# EasyEDA schematic display board.json
TITLE: Sheet_1; REV: 1.0; Date: 2021-07-18; Sheet: 1/1; Drawn By: Gustavo Moraes; Company: Your Company
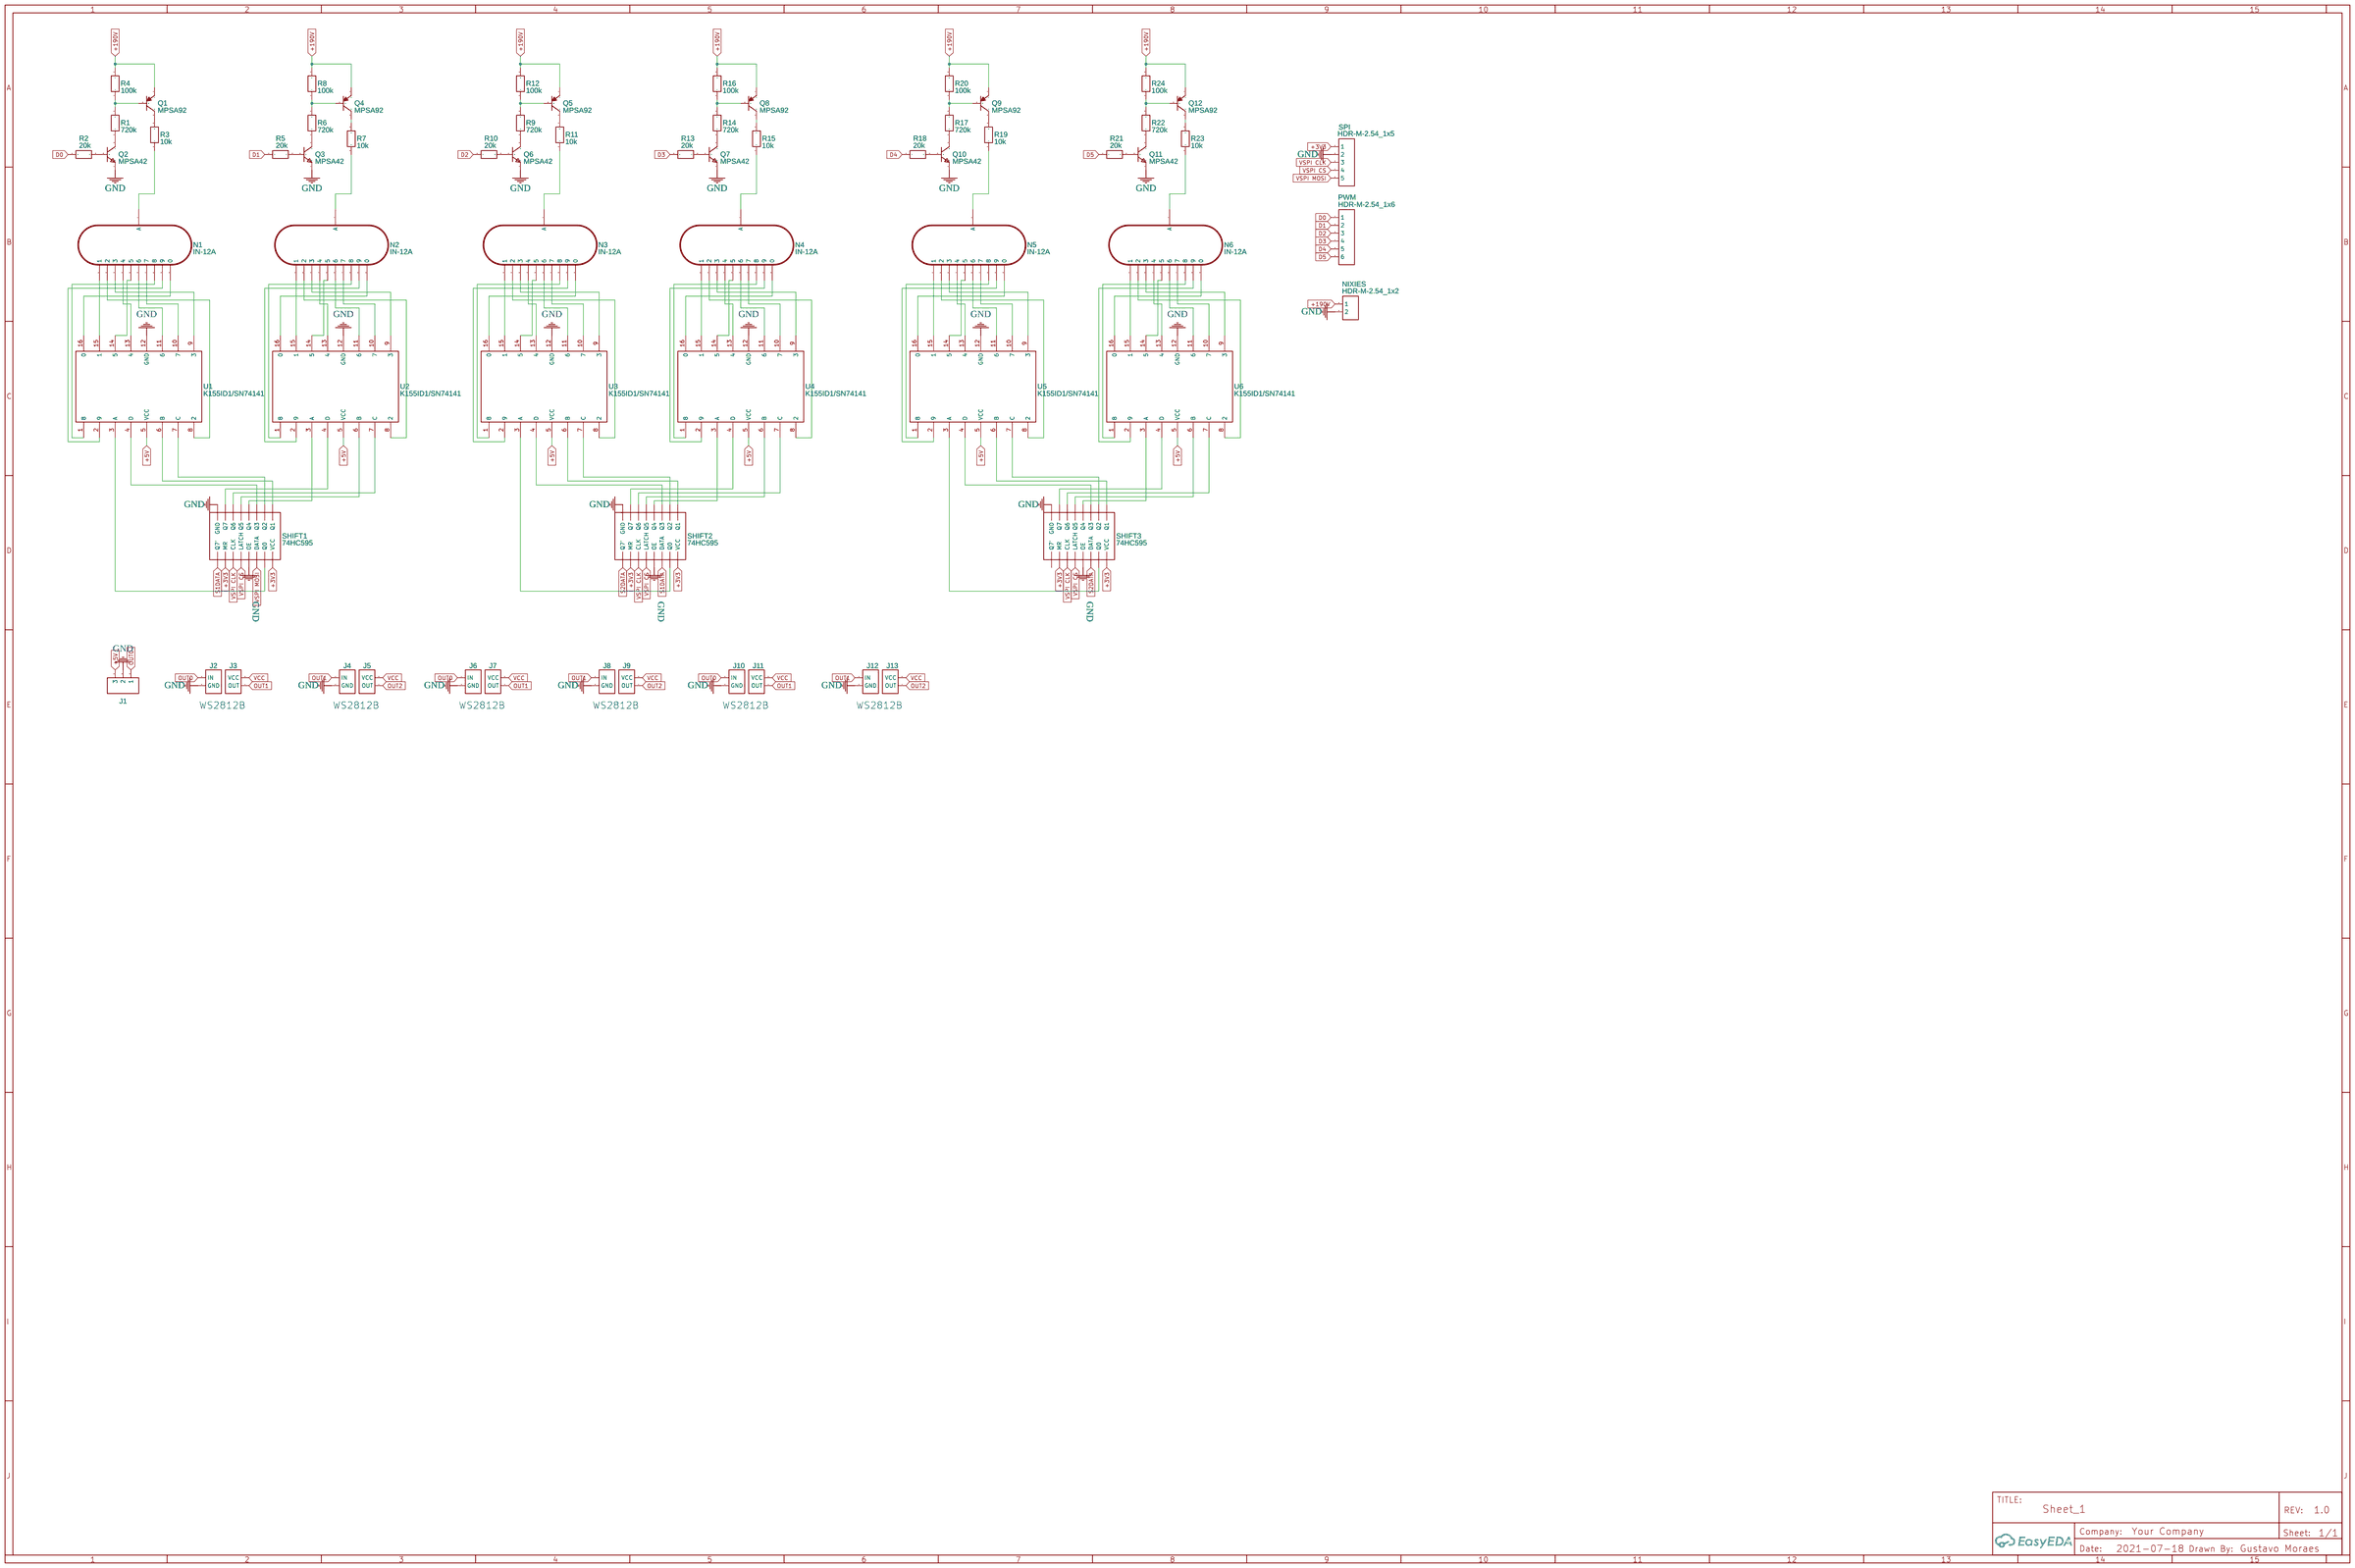
[diagram p0: schematic sheet]

## Parts
J1  HDR-M-2.54_1x3  [HDR-M-2.54_1X3]
J2  HDR-M-2.54_1x2  [HDR-M-2.54_1X2]
J3  HDR-M-2.54_1x2  [HDR-M-2.54_1X2]
J4  HDR-M-2.54_1x2  [HDR-M-2.54_1X2]
J5  HDR-M-2.54_1x2  [HDR-M-2.54_1X2]
J6  HDR-M-2.54_1x2  [HDR-M-2.54_1X2]
J7  HDR-M-2.54_1x2  [HDR-M-2.54_1X2]
J8  HDR-M-2.54_1x2  [HDR-M-2.54_1X2]
J9  HDR-M-2.54_1x2  [HDR-M-2.54_1X2]
J10  HDR-M-2.54_1x2  [HDR-M-2.54_1X2]
J11  HDR-M-2.54_1x2  [HDR-M-2.54_1X2]
J12  HDR-M-2.54_1x2  [HDR-M-2.54_1X2]
J13  HDR-M-2.54_1x2  [HDR-M-2.54_1X2]
N1  IN-12A  [IN-12]
N2  IN-12A  [IN-12]
N3  IN-12A  [IN-12]
N4  IN-12A  [IN-12]
N5  IN-12A  [IN-12]
N6  IN-12A  [IN-12]
NIXIES  HDR-M-2.54_1x2  [HDR-M-2.54_1X2]
PWM  HDR-M-2.54_1x6  [HDR-M-2.54_1X6]
Q1  MPSA92  [TO-92-3_L5.1-W4.1-P1.27-L]
Q2  MPSA42  [TO-92-3_L4.9-W3.7-P1.27-L]
Q3  MPSA42  [TO-92-3_L4.9-W3.7-P1.27-L]
Q4  MPSA92  [TO-92-3_L5.1-W4.1-P1.27-L]
Q5  MPSA92  [TO-92-3_L5.1-W4.1-P1.27-L]
Q6  MPSA42  [TO-92-3_L4.9-W3.7-P1.27-L]
Q7  MPSA42  [TO-92-3_L4.9-W3.7-P1.27-L]
Q8  MPSA92  [TO-92-3_L5.1-W4.1-P1.27-L]
Q9  MPSA92  [TO-92-3_L5.1-W4.1-P1.27-L]
Q10  MPSA42  [TO-92-3_L4.9-W3.7-P1.27-L]
Q11  MPSA42  [TO-92-3_L4.9-W3.7-P1.27-L]
Q12  MPSA92  [TO-92-3_L5.1-W4.1-P1.27-L]
R1  720k  [R_AXIAL-0.3]
R2  20k  [R_AXIAL-0.3]
R3  10k  [R_AXIAL-0.3]
R4  100k  [R_AXIAL-0.3]
R5  20k  [R_AXIAL-0.3]
R6  720k  [R_AXIAL-0.3]
R7  10k  [R_AXIAL-0.3]
R8  100k  [R_AXIAL-0.3]
R9  720k  [R_AXIAL-0.3]
R10  20k  [R_AXIAL-0.3]
R11  10k  [R_AXIAL-0.3]
R12  100k  [R_AXIAL-0.3]
R13  20k  [R_AXIAL-0.3]
R14  720k  [R_AXIAL-0.3]
R15  10k  [R_AXIAL-0.3]
R16  100k  [R_AXIAL-0.3]
R17  720k  [R_AXIAL-0.3]
R18  20k  [R_AXIAL-0.3]
R19  10k  [R_AXIAL-0.3]
R20  100k  [R_AXIAL-0.3]
R21  20k  [R_AXIAL-0.3]
R22  720k  [R_AXIAL-0.3]
R23  10k  [R_AXIAL-0.3]
R24  100k  [R_AXIAL-0.3]
SHIFT1  74HC595  [DIP-16]
SHIFT2  74HC595  [DIP-16]
SHIFT3  74HC595  [DIP-16]
SPI  HDR-M-2.54_1x5  [HDR-M-2.54_1X5]
U1  K155ID1/SN74141  [DIP16]
U2  K155ID1/SN74141  [DIP16]
U3  K155ID1/SN74141  [DIP16]
U4  K155ID1/SN74141  [DIP16]
U5  K155ID1/SN74141  [DIP16]
U6  K155ID1/SN74141  [DIP16]

## Library data of the parts
J1 = HDR-M-2.54_1x3: Supplier Part: C180248; Supplier: LCSC; Contributor: LCEDA_Lib
J2-J13 NIXIES = HDR-M-2.54_1x2: Supplier Part: C124375; Supplier: LCSC; Contributor: LCEDA_Lib
N1-N6 = IN-12A
PWM = HDR-M-2.54_1x6: Supplier Part: C190819; Supplier: LCSC; Contributor: LCEDA_Lib
Q1 Q4 Q5 Q8 Q9 Q12 = MPSA92: Supplier: LCSC; Manufacturer: SEMTECH; Supplier Part: C118558; JLCPCB Part Class: Extended Part
Q2 Q3 Q6 Q7 Q10 Q11 = MPSA42: Supplier: LCSC; Manufacturer: SEMTECH; Contributor: LCSC; Supplier Part: C118557; JLCPCB Part Class: Extended Part
R1-R24 = R_AXIAL-0.3_EU: Contributor: LCEDA_Lib
SHIFT1-SHIFT3 = 74HC595: Contributor: prizmi.linek
SPI = HDR-M-2.54_1x5: Supplier Part: C358687; Supplier: LCSC; Contributor: LCEDA_Lib
U1-U6 = K155ID1/SN74141: Contributor: Sjoertdb

## Nets
+3V3: SHIFT1.10(MR) SHIFT1.16(VCC) SHIFT2.10(MR) SHIFT2.16(VCC) SHIFT3.10(MR) SHIFT3.16(VCC) SPI.1
+5V: J1.3 U1.5(VCC) U2.5(VCC) U3.5(VCC) U4.5(VCC) U5.5(VCC) U6.5(VCC)
+190V: NIXIES.1 Q1.1 Q4.1 Q5.1 Q8.1 Q9.1 Q12.1 R4.2 R8.2 R12.2 R16.2 R20.2 R24.2
GND: J1.2 J2.2(GND) J4.2(GND) J6.2(GND) J8.2(GND) J10.2(GND) J12.2(GND) NIXIES.2 Q2.1(E) Q3.1(E) Q6.1(E) Q7.1(E) Q10.1(E) Q11.1(E) SHIFT1.8(GND) SHIFT1.13(OE) SHIFT2.8(GND) SHIFT2.13(OE) SHIFT3.8(GND) SHIFT3.13(OE) SPI.2 U1.12(GND) U2.12(GND) U3.12(GND) U4.12(GND) U5.12(GND) U6.12(GND)
VCC: J3.2(VCC) J5.2(VCC) J7.2(VCC) J9.2(VCC) J11.2(VCC) J13.2(VCC)
D0: PWM.1 R2.1
D1: PWM.2 R5.1
D2: PWM.3 R10.1
D3: PWM.4 R13.1
D4: PWM.5 R18.1
D5: PWM.6 R21.1
OUT0: J1.1 J2.1(IN) J6.1(IN) J10.1(IN)
OUT1: J3.1(OUT) J4.1(IN) J7.1(OUT) J8.1(IN) J11.1(OUT) J12.1(IN)
OUT2: J5.1(OUT) J9.1(OUT) J13.1(OUT)
S1DATA: SHIFT1.9(Q7') SHIFT2.14(DATA)
S2DATA: SHIFT2.9(Q7') SHIFT3.14(DATA)
VSPI CLK: SHIFT1.11(CLK) SHIFT2.11(CLK) SHIFT3.11(CLK) SPI.3
VSPI CS: SHIFT1.12(LATCH) SHIFT2.12(LATCH) SHIFT3.12(LATCH) SPI.4
VSPI MOSI: SHIFT1.14(DATA) SPI.5
Net-(N1-0): N1.0 U1.16(0)
Net-(N1-1): N1.1 U1.15(1)
Net-(N1-2): N1.2 U1.8(2)
Net-(N1-3): N1.3 U1.9(3)
Net-(N1-4): N1.4 U1.13(4)
Net-(N1-5): N1.5 U1.14(5)
Net-(N1-6): N1.6 U1.11(6)
Net-(N1-7): N1.7 U1.10(7)
Net-(N1-8): N1.8 U1.1(8)
Net-(N1-9): N1.9 U1.2(9)
Net-(N1-A): N1.A R3.1
Net-(N2-0): N2.0 U2.16(0)
Net-(N2-1): N2.1 U2.15(1)
Net-(N2-2): N2.2 U2.8(2)
Net-(N2-3): N2.3 U2.9(3)
Net-(N2-4): N2.4 U2.13(4)
Net-(N2-5): N2.5 U2.14(5)
Net-(N2-6): N2.6 U2.11(6)
Net-(N2-7): N2.7 U2.10(7)
Net-(N2-8): N2.8 U2.1(8)
Net-(N2-9): N2.9 U2.2(9)
Net-(N2-A): N2.A R7.1
Net-(N3-0): N3.0 U3.16(0)
Net-(N3-1): N3.1 U3.15(1)
Net-(N3-2): N3.2 U3.8(2)
Net-(N3-3): N3.3 U3.9(3)
Net-(N3-4): N3.4 U3.13(4)
Net-(N3-5): N3.5 U3.14(5)
Net-(N3-6): N3.6 U3.11(6)
Net-(N3-7): N3.7 U3.10(7)
Net-(N3-8): N3.8 U3.1(8)
Net-(N3-9): N3.9 U3.2(9)
Net-(N3-A): N3.A R11.1
Net-(N4-0): N4.0 U4.16(0)
Net-(N4-1): N4.1 U4.15(1)
Net-(N4-2): N4.2 U4.8(2)
Net-(N4-3): N4.3 U4.9(3)
Net-(N4-4): N4.4 U4.13(4)
Net-(N4-5): N4.5 U4.14(5)
Net-(N4-6): N4.6 U4.11(6)
Net-(N4-7): N4.7 U4.10(7)
Net-(N4-8): N4.8 U4.1(8)
Net-(N4-9): N4.9 U4.2(9)
Net-(N4-A): N4.A R15.1
Net-(N5-0): N5.0 U5.16(0)
Net-(N5-1): N5.1 U5.15(1)
Net-(N5-2): N5.2 U5.8(2)
Net-(N5-3): N5.3 U5.9(3)
Net-(N5-4): N5.4 U5.13(4)
Net-(N5-5): N5.5 U5.14(5)
Net-(N5-6): N5.6 U5.11(6)
Net-(N5-7): N5.7 U5.10(7)
Net-(N5-8): N5.8 U5.1(8)
Net-(N5-9): N5.9 U5.2(9)
Net-(N5-A): N5.A R19.1
Net-(N6-0): N6.0 U6.16(0)
Net-(N6-1): N6.1 U6.15(1)
Net-(N6-2): N6.2 U6.8(2)
Net-(N6-3): N6.3 U6.9(3)
Net-(N6-4): N6.4 U6.13(4)
Net-(N6-5): N6.5 U6.14(5)
Net-(N6-6): N6.6 U6.11(6)
Net-(N6-7): N6.7 U6.10(7)
Net-(N6-8): N6.8 U6.1(8)
Net-(N6-9): N6.9 U6.2(9)
Net-(N6-A): N6.A R23.1
Net-(Q1-2): Q1.2 R1.2 R4.1
Net-(Q1-3): Q1.3 R3.2
Net-(Q2-2): Q2.2(B) R2.2
Net-(Q2-3): Q2.3(C) R1.1
Net-(Q3-2): Q3.2(B) R5.2
Net-(Q3-3): Q3.3(C) R6.1
Net-(Q4-2): Q4.2 R6.2 R8.1
Net-(Q4-3): Q4.3 R7.2
Net-(Q5-2): Q5.2 R9.2 R12.1
Net-(Q5-3): Q5.3 R11.2
Net-(Q6-2): Q6.2(B) R10.2
Net-(Q6-3): Q6.3(C) R9.1
Net-(Q7-2): Q7.2(B) R13.2
Net-(Q7-3): Q7.3(C) R14.1
Net-(Q8-2): Q8.2 R14.2 R16.1
Net-(Q8-3): Q8.3 R15.2
Net-(Q9-2): Q9.2 R17.2 R20.1
Net-(Q9-3): Q9.3 R19.2
Net-(Q10-2): Q10.2(B) R18.2
Net-(Q10-3): Q10.3(C) R17.1
Net-(Q11-2): Q11.2(B) R21.2
Net-(Q11-3): Q11.3(C) R22.1
Net-(Q12-2): Q12.2 R22.2 R24.1
Net-(Q12-3): Q12.3 R23.2
Net-(SHIFT1-1): SHIFT1.1(Q1) U1.6(B)
Net-(SHIFT1-2): SHIFT1.2(Q2) U1.7(C)
Net-(SHIFT1-3): SHIFT1.3(Q3) U1.4(D)
Net-(SHIFT1-4): SHIFT1.4(Q4) U2.3(A)
Net-(SHIFT1-5): SHIFT1.5(Q5) U2.6(B)
Net-(SHIFT1-6): SHIFT1.6(Q6) U2.7(C)
Net-(SHIFT1-7): SHIFT1.7(Q7) U2.4(D)
Net-(SHIFT1-15): SHIFT1.15(Q0) U1.3(A)
Net-(SHIFT2-1): SHIFT2.1(Q1) U3.6(B)
Net-(SHIFT2-2): SHIFT2.2(Q2) U3.7(C)
Net-(SHIFT2-3): SHIFT2.3(Q3) U3.4(D)
Net-(SHIFT2-4): SHIFT2.4(Q4) U4.3(A)
Net-(SHIFT2-5): SHIFT2.5(Q5) U4.6(B)
Net-(SHIFT2-6): SHIFT2.6(Q6) U4.7(C)
Net-(SHIFT2-7): SHIFT2.7(Q7) U4.4(D)
Net-(SHIFT2-15): SHIFT2.15(Q0) U3.3(A)
Net-(SHIFT3-1): SHIFT3.1(Q1) U5.6(B)
Net-(SHIFT3-2): SHIFT3.2(Q2) U5.7(C)
Net-(SHIFT3-3): SHIFT3.3(Q3) U5.4(D)
Net-(SHIFT3-4): SHIFT3.4(Q4) U6.3(A)
Net-(SHIFT3-5): SHIFT3.5(Q5) U6.6(B)
Net-(SHIFT3-6): SHIFT3.6(Q6) U6.7(C)
Net-(SHIFT3-7): SHIFT3.7(Q7) U6.4(D)
Net-(SHIFT3-15): SHIFT3.15(Q0) U5.3(A)

Not connected (* = marked no-connect by the designer): SHIFT3 9(Q7')

## Notes on the sheet
- WS2812B
- WS2812B
- WS2812B
- WS2812B
- WS2812B
- WS2812B
